# Altium schematic sheet SwitchUniControl.SchDoc
size A4
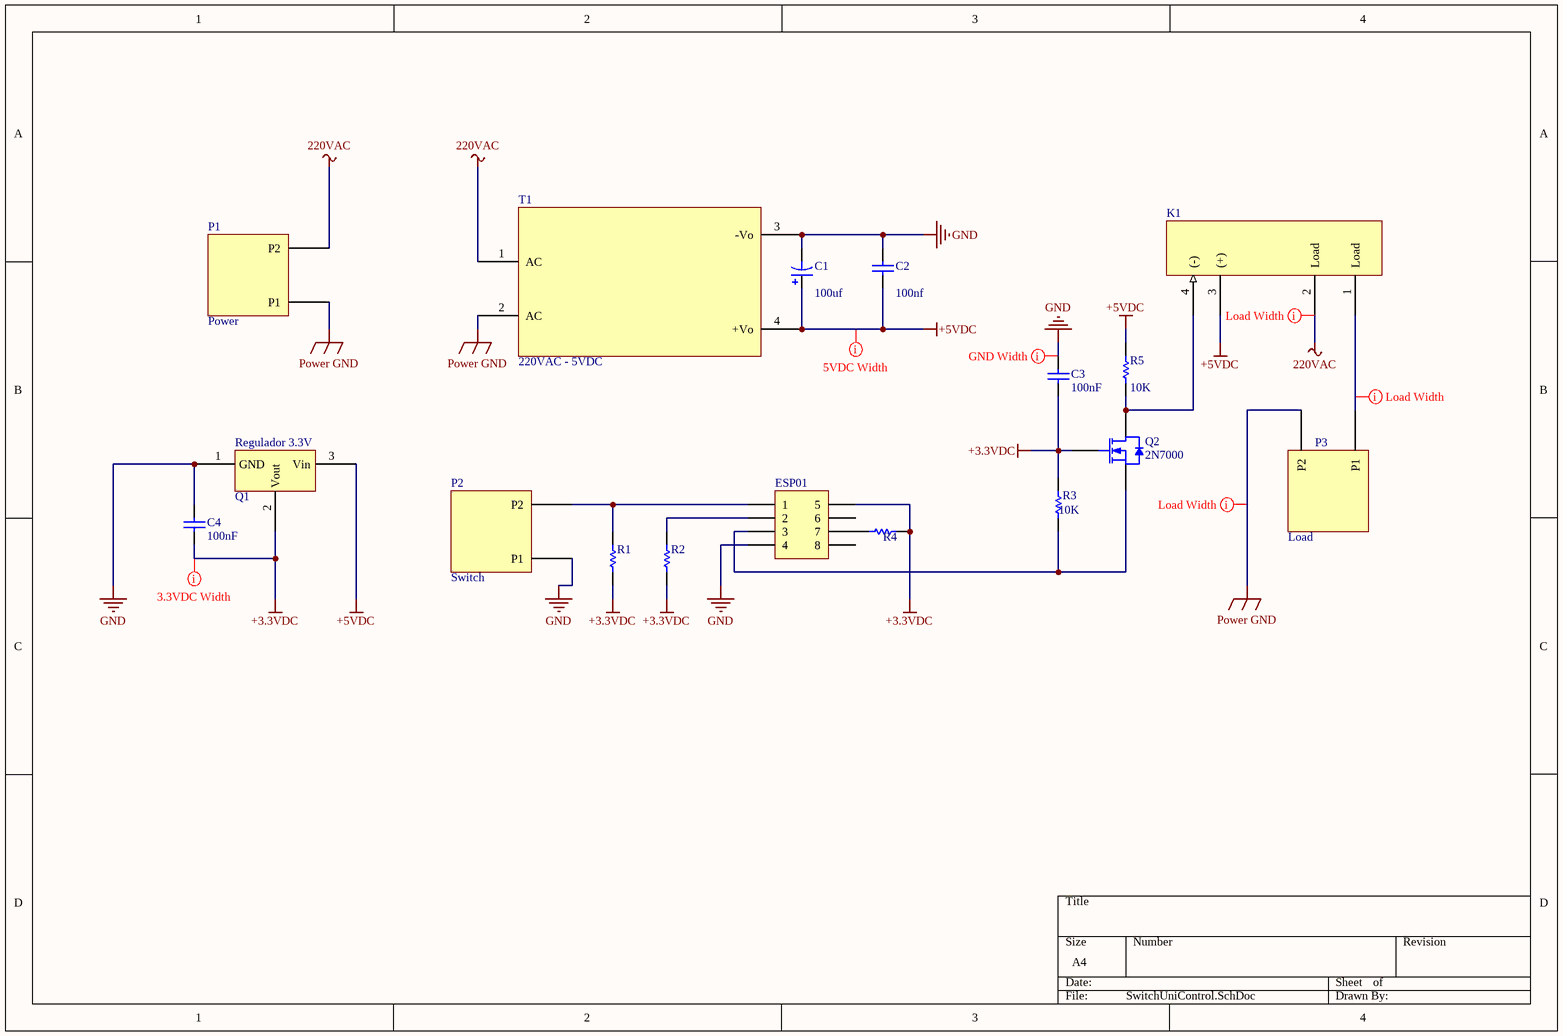
[diagram p0: SwitchUniControl.SchDoc]

## Parts
C1  value 100uf  [RAD-0.1]  (hidden comment: Cap Pol1)
C2  value 100nf  [RAD-0.1]  (hidden comment: Cap)
C3  value 100nF  [RAD-0.1]  (hidden comment: Cap)
C4  value 100nF  [RAD-0.1]  (hidden comment: Cap)
ESP01  Header 4X2A  [HDR2X4_CEN]  (value not drawn)
K1  G3MB-202P DC5  [G3MB-202P DC5]  (value not drawn)
P1  Power  [ScrewTerminal-X2]
P2  Switch  [ScrewTerminal-X2]
P3  Load  [ScrewTerminal-X2]
Q1  Regulador 3.3V  [TO220]
Q2  2N7000  [SOT54]
R1  Res1  [AXIAL-0.3]  (value not drawn)
R2  Res1  [AXIAL-0.3]  (value not drawn)
R3  value 10K  [AXIAL-0.3]  (hidden comment: Res1)
R4  Res1  [AXIAL-0.3]  (value not drawn)
R5  value 10K  [AXIAL-0.3]  (hidden comment: Res1)
T1  220VAC - 5VDC  [HLK-PM]

## Nets
220VAC: K1.2(Load) P1.2(P2) T1.1(AC)
+3.3VDC: C3.2 C4.2 ESP01.5 Q1.2(Vout) Q2.2(G) R1.1 R2.1 R3.2 R4.2
+5VDC: C1.1 C2.1 K1.3((+)) Q1.3(Vin) R5.2 T1.4(+Vo)
GND: C1.2 C2.2 C3.1 C4.1 ESP01.4 P2.1(P1) Q1.1(GND) T1.3(-Vo)
Power GND: P1.1(P1) P3.2(P2) T1.2(AC)
NetESP01_1: ESP01.1 P2.2(P2) R1.2
NetESP01_2: ESP01.2 R2.2
NetESP01_3: ESP01.3 Q2.3(S) R3.1
NetESP01_7: ESP01.7 R4.1
NetK1_1: K1.1(Load) P3.1(P1)
NetK1_4: K1.4((-)) Q2.1(D) R5.1

Not connected (* = marked no-connect by the designer): ESP01 6 8

## Layout directives
rule Width Constraint [Pref Width = 90mil    Min Width = 60mil    Max Width = 100mil]: 220VAC, NetK1_1, Power GND
rule Width Constraint [Pref Width = 25mil    Min Width = 20mil    Max Width = 30mil]: +3.3VDC, +5VDC, GND

## Library data of the parts
C1 = Cap Pol1: Polarized Capacitor (Radial); Published: 8-Jun-2000; LatestRevisionDate: 17-Jul-2002; LatestRevisionNote: Re-released for DXP Platform.; PackageReference: RB7.6-15; Publisher: Altium Limited; PackageDescription: Polarized Capacitor (Radial); 2 Leads
C2-C4 = Cap: Capacitor; Published: 8-Jun-2000; LatestRevisionDate: 17-Jul-2002; LatestRevisionNote: Re-released for DXP Platform.; PackageReference: RAD-0.3; Publisher: Altium Limited; PackageDescription: Radial Cap, Thru-Hole; 2 Leads; 0.3 in Pin Spacing
ESP01 = Header 4X2A: Header, 4-Pin, Dual row; LatestRevisionDate: 17-Jul-2002; LatestRevisionNote: Re-released for DXP Platform.; Publisher: Altium Limited
K1 = G3MB-202P DC5: RELAY MINI SSR 240VAC@2A ZERO; Mfr: Omron; Mfr PN: G3MB-202P DC5
P1-P3 = ScrewTerminal
Q1 = AMS1117
Q2 = 2N7000: N-channel Enhancement Mode Field-effect Transistor; Published: 17-Sep-2003; LatestRevisionDate: 12-Dec-2006; LatestRevisionNote: Footprint pad sequence fixed.; DatasheetVersion: 19-May-2000; PackageVersion: Feb-1997; PackageReference: SOT54; Publisher: Altium Limited; PackageDescription: Plastic Single-Ended Leaded (through hole) package; 3 Leads (TO-92); Code_JEITA: SC-43; Code_JEDEC: TO-92; ComponentLink1Description: Manufacturer Link; ComponentLink1URL: http://www.semiconductors.philips.com/; ComponentLink2Description: Datasheet; ComponentLink2URL: http://www.semiconductors.philips.com/acrobat/datasheets/2N7000-03.pdf
R1 R2 = Res1: Resistor; Value: 10K; Published: 8-Jun-2000; LatestRevisionDate: 17-Jul-2002; LatestRevisionNote: Re-released for DXP Platform.; PackageReference: AXIAL-0.3; Publisher: Altium Limited; PackageDescription: Axial Device, Thru-Hole; 2 Leads; 0.3 in Pin Spacing
R3 R5 = Res1: Resistor; Published: 8-Jun-2000; LatestRevisionDate: 17-Jul-2002; LatestRevisionNote: Re-released for DXP Platform.; PackageReference: AXIAL-0.3; Publisher: Altium Limited; PackageDescription: Axial Device, Thru-Hole; 2 Leads; 0.3 in Pin Spacing
R4 = Res1: Resistor; Value: 1K; Published: 8-Jun-2000; LatestRevisionDate: 17-Jul-2002; LatestRevisionNote: Re-released for DXP Platform.; PackageReference: AXIAL-0.3; Publisher: Altium Limited; PackageDescription: Axial Device, Thru-Hole; 2 Leads; 0.3 in Pin Spacing
T1 = HLK-PM: HLK-PM*; Mfr: HLK-PM01